# Altium schematic sheet SY_HR08_MCU_INTERFACE_V1.1.SchDoc
size A3; PageSetup: Record=PageOptions|CenterHorizontal=True|CenterVertical=True|PrintScale=0.71|XCorrection=1.00|YCorrection=1.00|PrintKind=2|BorderSize=5000000|LeftOffset=0|BottomOffset=0|Orientation=2|PaperLength=1000|PaperWidth=1000|Scale=100|PaperSource=7|PrintQuality=-3|MediaType=1|DitherType=10|PrintScaleMode=1|PaperKind=A4|PaperIndex=9
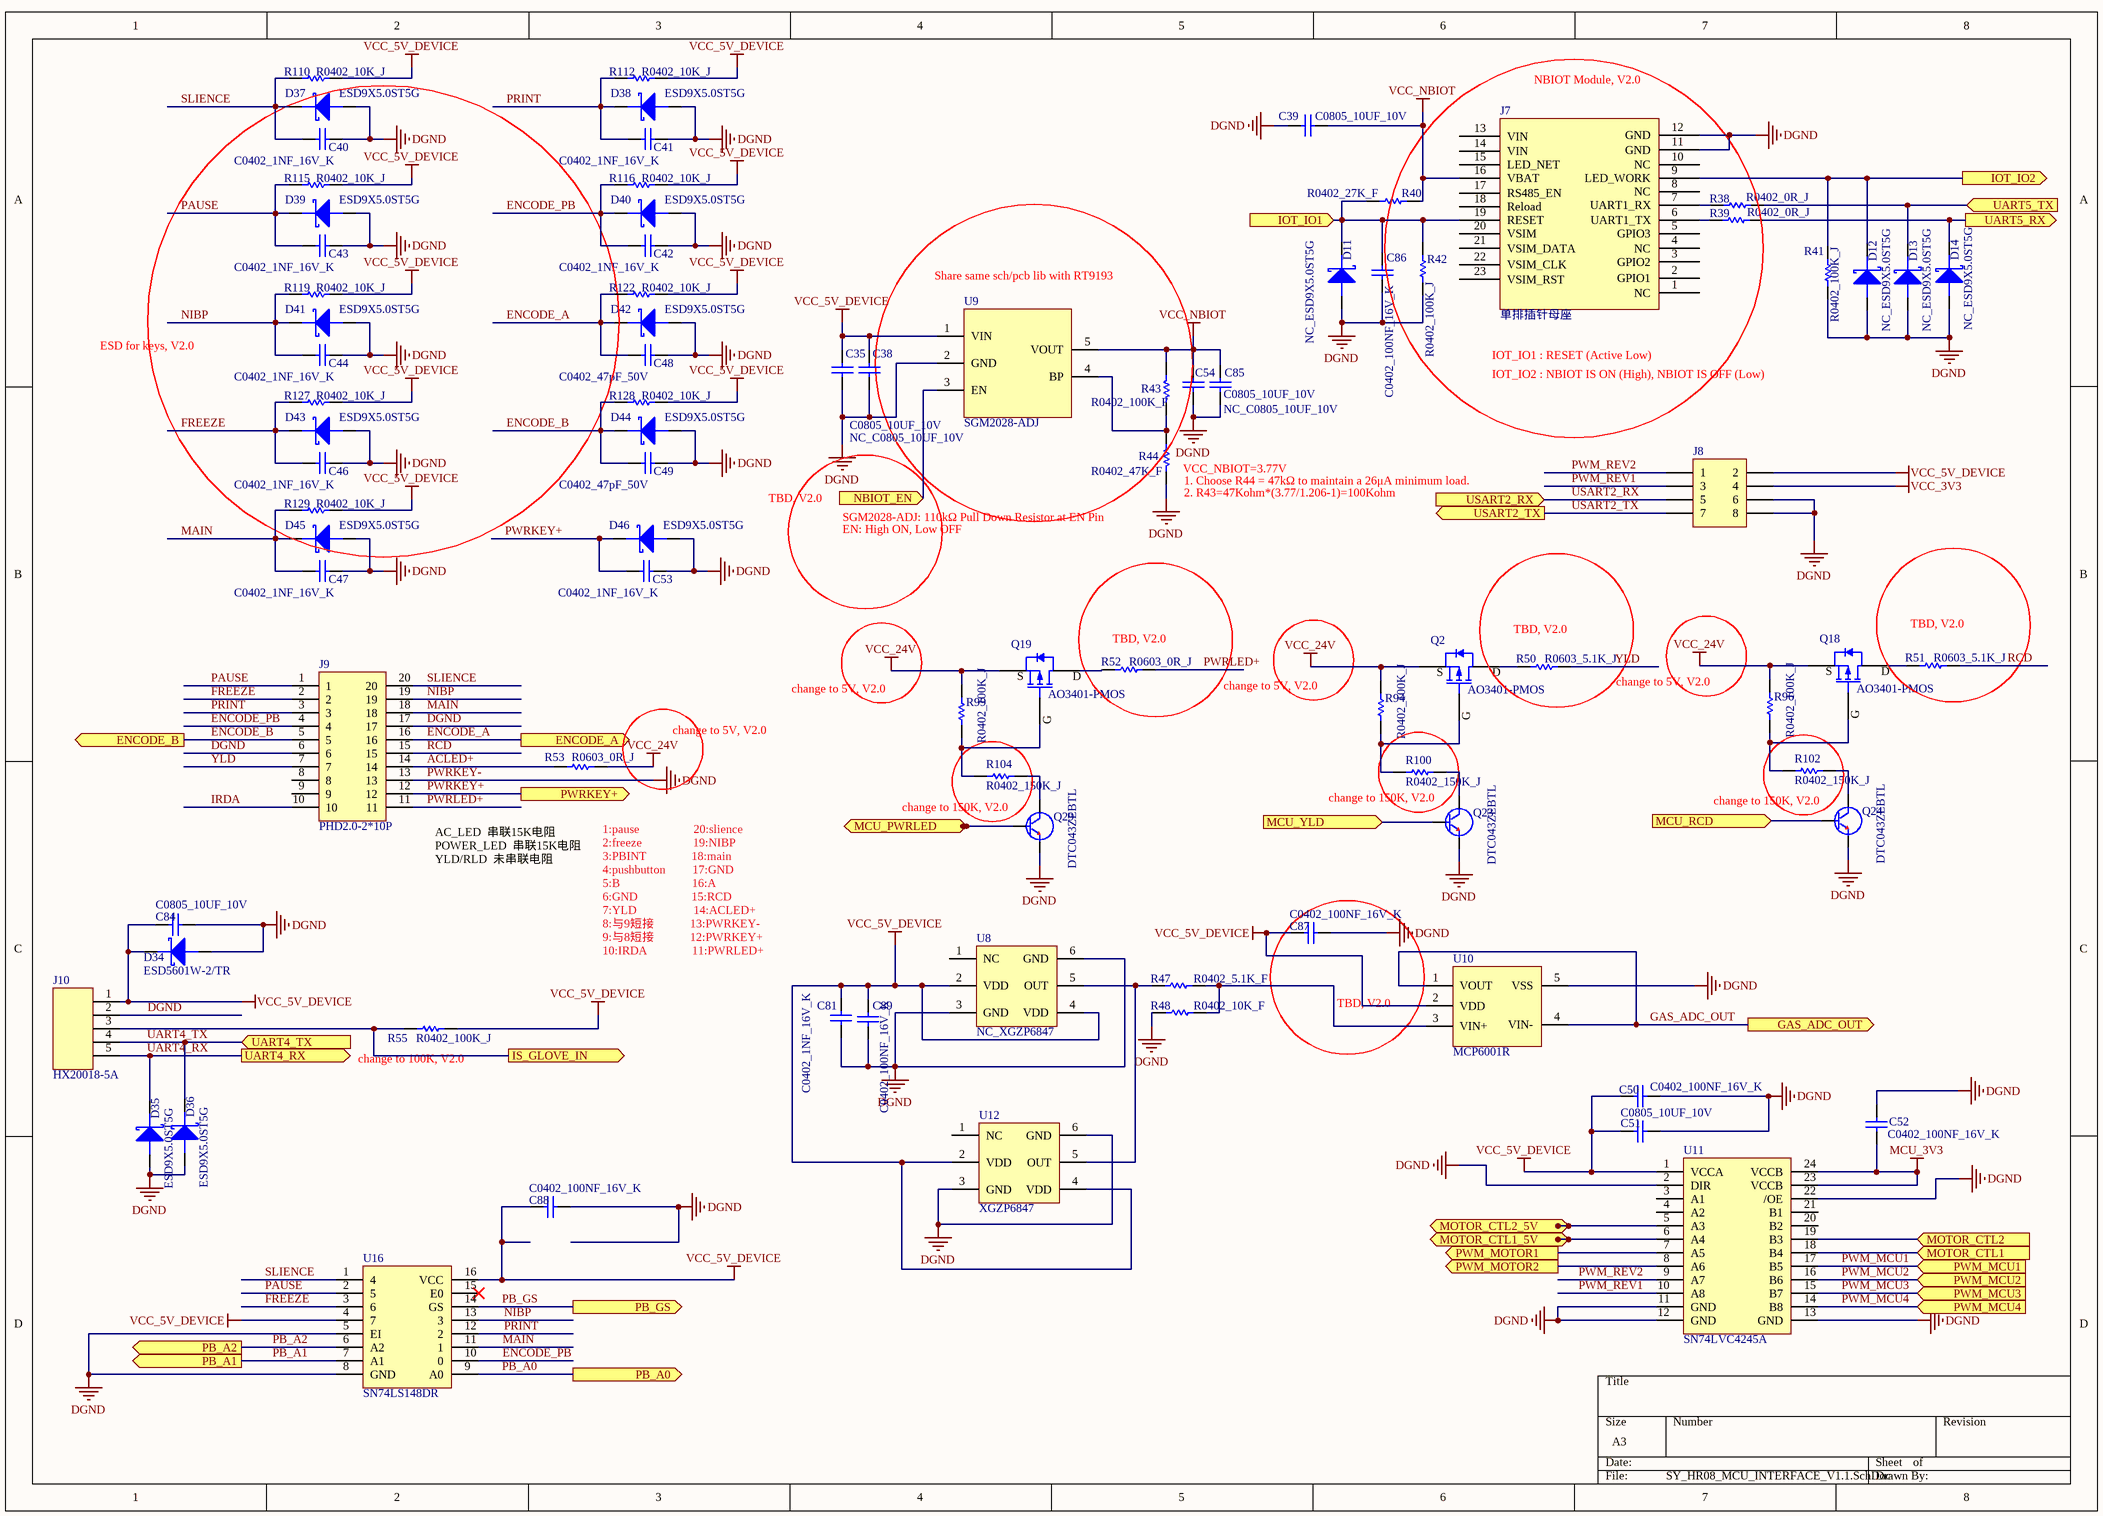
[diagram p0: SY_HR08_MCU_INTERFACE_V1.1.SchDoc]

## Parts
C35  C0805_10UF_10V  [CAP0805-B]
C38  NC_C0805_10UF_10V  [CAP0805-B]
C39  C0805_10UF_10V  [CAP0805-B]
C40  C0402_1NF_16V_K  [CAP0402_HQ]
C41  C0402_1NF_16V_K  [CAP0402_HQ]
C42  C0402_1NF_16V_K  [CAP0402_HQ]
C43  C0402_1NF_16V_K  [CAP0402_HQ]
C44  C0402_1NF_16V_K  [CAP0402_HQ]
C46  C0402_1NF_16V_K  [CAP0402_HQ]
C47  C0402_1NF_16V_K  [CAP0402_HQ]
C48  C0402_47pF_50V  [CAP0402_HQ]
C49  C0402_47pF_50V  [CAP0402_HQ]
C50  C0402_100NF_16V_K  [CAP0402_HQ]
C51  C0805_10UF_10V  [CAP0805-B]
C52  C0402_100NF_16V_K  [CAP0402_HQ]
C53  C0402_1NF_16V_K  [CAP0402_HQ]
C54  NC_C0805_10UF_10V  [CAP0805-B]
C81  C0402_1NF_16V_K  [CAP0402_HQ]
C84  C0805_10UF_10V  [CAP0805-B]
C85  C0805_10UF_10V  [CAP0805-B]
C86  C0402_100NF_16V_K  [CAP0402_HQ]
C87  C0402_100NF_16V_K  [CAP0402_HQ]
C88  C0402_100NF_16V_K  [CAP0402_HQ]
C89  C0402_100NF_16V_K  [CAP0402_HQ]
D11  NC_ESD9X5.0ST5G  [ESD9X5.0ST5G]
D12  NC_ESD9X5.0ST5G  [ESD9X5.0ST5G]
D13  NC_ESD9X5.0ST5G  [ESD9X5.0ST5G]
D14  NC_ESD9X5.0ST5G  [ESD9X5.0ST5G]
D34  ESD5601W-2/TR  [ESD5601W-2$2F$TR]
D35  ESD9X5.0ST5G  [ESD9X5.0ST5G]
D36  ESD9X5.0ST5G  [ESD9X5.0ST5G]
D37  ESD9X5.0ST5G  [ESD9X5.0ST5G]
D38  ESD9X5.0ST5G  [ESD9X5.0ST5G]
D39  ESD9X5.0ST5G  [ESD9X5.0ST5G]
D40  ESD9X5.0ST5G  [ESD9X5.0ST5G]
D41  ESD9X5.0ST5G  [ESD9X5.0ST5G]
D42  ESD9X5.0ST5G  [ESD9X5.0ST5G]
D43  ESD9X5.0ST5G  [ESD9X5.0ST5G]
D44  ESD9X5.0ST5G  [ESD9X5.0ST5G]
D45  ESD9X5.0ST5G  [ESD9X5.0ST5G]
D46  ESD9X5.0ST5G  [ESD9X5.0ST5G]
J7  单排插针母座  [USR-LTE-7S4]
J8  双排插针  [CON2X4(2.54MM)]  (value not drawn)
J9  PHD2.0-2*10P  [PHD2.0-20P]
J10  HX20018-5A  [HX20018-5A]
Q2  AO3401-PMOS  [AO3400]
Q18  AO3401-PMOS  [AO3400]
Q19  AO3401-PMOS  [AO3400]
Q23  DTC043ZEBTL  [DTC043ZEBTL$2F$$2F$DTC143ZE$2F$$2F$LDTC143ZET1G]
Q24  DTC043ZEBTL  [DTC043ZEBTL$2F$$2F$DTC143ZE$2F$$2F$LDTC143ZET1G]
Q29  DTC043ZEBTL  [DTC043ZEBTL$2F$$2F$DTC143ZE$2F$$2F$LDTC143ZET1G]
R38  R0402_0R_J  [RES0402_HQ]
R39  R0402_0R_J  [RES0402_HQ]
R40  R0402_27K_F  [RES0402_HQ]
R41  R0402_100K_J  [RES0402_HQ]
R42  R0402_100K_J  [RES0402_HQ]
R43  R0402_100K_F  [RES0402_HQ]
R44  R0402_47K_F  [RES0402_HQ]
R47  R0402_5.1K_F  [RES0402_HQ]
R48  R0402_10K_F  [RES0402_HQ]
R50  R0603_5.1K_J  [RES0603-A]
R51  R0603_5.1K_J  [RES0603-A]
R52  R0603_0R_J  [RES0603-A]
R53  R0603_0R_J  [RES0603-A]
R55  R0402_100K_J  [RES0402_HQ]
R94  R0402_100K_J  [RES0402_HQ]
R96  R0402_100K_J  [RES0402_HQ]
R99  R0402_100K_J  [RES0402_HQ]
R100  R0402_150K_J  [RES0402_HQ]
R102  R0402_150K_J  [RES0402_HQ]
R104  R0402_150K_J  [RES0402_HQ]
R110  R0402_10K_J  [RES0402_HQ]
R112  R0402_10K_J  [RES0402_HQ]
R115  R0402_10K_J  [RES0402_HQ]
R116  R0402_10K_J  [RES0402_HQ]
R119  R0402_10K_J  [RES0402_HQ]
R122  R0402_10K_J  [RES0402_HQ]
R127  R0402_10K_J  [RES0402_HQ]
R128  R0402_10K_J  [RES0402_HQ]
R129  R0402_10K_J  [RES0402_HQ]
U8  NC_XGZP6847  [XGZP6847300KPA]
U9  SGM2028-ADJ  [TPS7B6950]
U10  MCP6001R  [TOS23]
U11  SN74LVC4245A  [SN74LVC4245APW]
U12  XGZP6847  [XGZP6847300KPA]
U16  SN74LS148DR  [SOIC16_39MM]

## Ports
ENCODE_A (out), ENCODE_B (out), GAS_ADC_OUT (out), IOT_IO1 (in), IOT_IO2 (out), IS_GLOVE_IN (out), MCU_PWRLED (in), MCU_RCD (in), MCU_YLD (in), MOTOR_CTL1 (in), MOTOR_CTL1_5V (out), MOTOR_CTL2 (in), MOTOR_CTL2_5V (out), NBIOT_EN (in), PB_A0 (out), PB_A1 (out), PB_A2 (out), PB_GS (out), PWM_MCU1 (in), PWM_MCU2 (in), PWM_MCU3 (in), PWM_MCU4 (in), PWM_MOTOR1 (out), PWM_MOTOR2 (out), PWRKEY+ (out), UART4_RX (out), UART4_TX (in), UART5_RX (out), UART5_TX (in), USART2_RX (in), USART2_TX (out)

## Nets
DGND: C35.1 C38.1 C39.2 C40.1 C41.1 C42.1 C43.1 C44.1 C46.1 C47.1 C48.1 C49.1 C50.1 C51.2 C52.1 C53.1 C54.1 C81.2 C84.2 C85.1 C86.2 C87.1 C88.1 C89.2 D11.2 D12.2 D13.2 D14.2 D34.2 D35.2 D36.2 D37.2 D38.2 D39.2 D40.2 D41.2 D42.2 D43.2 D44.2 D45.2 D46.2 J7.11(GND) J7.12(GND) J8.6 J8.8 J9.6 J9.13 J9.17 J10.2 Q23.2(E) Q24.2(E) Q29.2(E) R41.1 R42.2 R44.1 R48.2 U8.3(GND) U8.6(GND) U9.2(GND) U10.5(VSS) U11.2(DIR) U11.11(GND) U11.12(GND) U11.13(GND) U11.22(/OE) U12.3(GND) U12.6(GND) U16.5(EI) U16.8(GND)  [also labelled PWRKEY-]
MCU_3V3: C52.2 U11.23(VCCB) U11.24(VCCB)
VCC_3V3: J8.4
VCC_5V_DEVICE: C35.2 C38.2 C50.2 C51.1 C81.1 C84.1 C87.2 C88.2 C89.1 D34.1 J8.2 J10.1 R55.2 R110.2 R112.2 R115.2 R116.2 R119.2 R122.2 R127.2 R128.2 R129.2 U8.2(VDD) U8.4(VDD) U9.1(VIN) U10.2(VDD) U11.1(VCCA) U12.2(VDD) U12.4(VDD) U16.4(7) U16.16(VCC)
VCC_24V: Q2.2(S) Q18.2(S) Q19.2(S) R53.2 R94.2 R96.2 R99.2
VCC_NBIOT: C39.1 C54.2 C85.2 J7.16(VBAT) R40.1 R43.2 U9.5(VOUT)
ACLED+: J9.14 R53.1
ENCODE_A: C48.2 D42.1 J9.16 R122.1 ; port ENCODE_A
ENCODE_B: C49.2 D44.1 J9.5 R128.1 ; port ENCODE_B
ENCODE_PB: C42.2 D40.1 J9.4 R116.1 U16.10(0)
FREEZE: C46.2 D43.1 J9.2 R127.1 U16.3(6)
GAS_ADC_OUT: U10.1(VOUT) U10.4(VIN-) ; port GAS_ADC_OUT
IOT_IO1: C86.1 D11.1 J7.19(RESET) R40.2 R42.1 ; port IOT_IO1
IOT_IO2: D12.1 J7.9(LED_WORK) R41.2 ; port IOT_IO2
IRDA: J9.10
IS_GLOVE_IN: J10.3 R55.1 ; port IS_GLOVE_IN
MAIN: C47.2 D45.1 J9.18 R129.1 U16.11(1)
MCU_PWRLED: Q29.1(B) ; port MCU_PWRLED
MCU_RCD: Q24.1(B) ; port MCU_RCD
MCU_YLD: Q23.1(B) ; port MCU_YLD
MOTOR_CTL1: U11.18(B4) ; port MOTOR_CTL1
MOTOR_CTL1_5V: U11.6(A4) ; port MOTOR_CTL1_5V
MOTOR_CTL2: U11.19(B3) ; port MOTOR_CTL2
MOTOR_CTL2_5V: U11.5(A3) ; port MOTOR_CTL2_5V
NBIOT_EN: U9.3(EN) ; port NBIOT_EN
NIBP: C44.2 D41.1 J9.19 R119.1 U16.13(3)
PAUSE: C43.2 D39.1 J9.1 R115.1 U16.2(5)
PB_A0: U16.9(A0) ; port PB_A0
PB_A1: U16.7(A1) ; port PB_A1
PB_A2: U16.6(A2) ; port PB_A2
PB_GS: U16.14(GS) ; port PB_GS
PRINT: C41.2 D38.1 J9.3 R112.1 U16.12(2)
PWM_MCU1: U11.17(B5) ; port PWM_MCU1
PWM_MCU2: U11.16(B6) ; port PWM_MCU2
PWM_MCU3: U11.15(B7) ; port PWM_MCU3
PWM_MCU4: U11.14(B8) ; port PWM_MCU4
PWM_MOTOR1: U11.7(A5) ; port PWM_MOTOR1
PWM_MOTOR2: U11.8(A6) ; port PWM_MOTOR2
PWM_REV1: J8.3 U11.10(A8)
PWM_REV2: J8.1 U11.9(A7)
PWRKEY+: C53.2 D46.1 J9.12 ; port PWRKEY+
PWRLED+: J9.11 R52.2
RCD: J9.15 R51.2
SLIENCE: C40.2 D37.1 J9.20 R110.1 U16.1(4)
UART4_RX: D35.1 J10.5 ; port UART4_RX
UART4_TX: D36.1 J10.4 ; port UART4_TX
UART5_RX: D14.1 R39.1 ; port UART5_RX
UART5_TX: D13.1 R38.2 ; port UART5_TX
USART2_RX: J8.5 ; port USART2_RX
USART2_TX: J8.7 ; port USART2_TX
YLD: J9.7 R50.2
NetJ7_6: J7.6(UART1_TX) R39.2
NetJ7_7: J7.7(UART1_RX) R38.1
NetQ2_1: Q2.1(G) R94.1 R100.2
NetQ2_3: Q2.3(D) R50.1
NetQ18_1: Q18.1(G) R96.1 R102.2
NetQ18_3: Q18.3(D) R51.1
NetQ19_1: Q19.1(G) R99.1 R104.2
NetQ19_3: Q19.3(D) R52.1
NetQ23_3: Q23.3(C) R100.1
NetQ24_3: Q24.3(C) R102.1
NetQ29_3: Q29.3(C) R104.1
NetR43_1: R43.1 R44.2 U9.4(BP)
NetR47_1: R47.1 R48.1 U10.3(VIN+)
NetR47_2: R47.2 U8.5(OUT) U12.5(OUT)

Not connected (* = marked no-connect by the designer): J7 1(NC) 2(GPIO1) 3(GPIO2) 4(NC) 5(GPIO3) 8(NC) 10(NC) 13(VIN) 14(VIN) 15(LED_NET) 17(RS485_EN) 18(Reload) 20(VSIM) 21(VSIM_DATA) 22(VSIM_CLK) 23(VSIM_RST); J9 8 9; U8 1(NC); U11 3(A1) 4(A2) 20(B2) 21(B1); U12 1(NC); U16 15(E0)*

## Notes on the sheet
- (near J7) NBIOT Module, V2.0
- (near U9) Share same sch/pcb lib with RT9193
- ESD for keys, V2.0
- IOT_IO1 : RESET (Active Low)
- IOT_IO2 : NBIOT IS ON (High), NBIOT IS OFF (Low)
- TBD, V2.0
- SGM2028-ADJ: 110kΩ Pull Down Resistor at EN Pin
- (near R44) VCC_NBIOT=3.77V
- (near R44) 1. Choose R44 = 47kΩ to maintain a 26μA minimum load.
- (near R44) 2. R43=47Kohm*(3.77/1.206-1)=100Kohm
- EN: High ON, Low OFF
- (near R52) TBD, V2.0
- (near R50) TBD, V2.0
- (near R51) TBD, V2.0
- change to 5V, V2.0
- (near R94) change to 5V, V2.0
- (near Q29) change to 150K, V2.0
- (near Q23) change to 150K, V2.0
- (near Q24) change to 150K, V2.0
- AC_LED  串联15K电阻
  POWER_LED  串联15K电阻
  YLD/RLD  未串联电阻
- 1:pause                  20:slience
  2:freeze                 19:NIBP
  3:PBINT               18:main
  4:pushbutton         17:GND
  5:B                        16:A
  6:GND                  15:RCD
  7:YLD                   14:ACLED+
  8:与9短接            13:PWRKEY-
  9:与8短接            12:PWRKEY+
  10:IRDA               11:PWRLED+
- (near R55) change to 100K, V2.0

## Library data of the parts
C35 C38 C39 C51 C54 C84 C85 = C0805_10UF_10V: 电容_10uF_0805_X5R_10V_K
C40-C44 C46-C50 C52 C53 C81 C86-C89 = C0402_100NF_16V_K: 电容_100nF_0402_X7R_16V_K; Geometry.Height: 0.55mm; Value: 100NF
D11-D14 D35-D46 = ESD9X5.0ST5G: TVS_单路_单向_5.0V_65pF; Manufacturer: ONSEMI(安森美); Part Number: HQ11510010010; Geometry.Height: 0.43mm
D34 = ESD5601W-2/TR: TVS_浪涌+静电二合一管_单向_7V_170pf; Manufacturer: Will(韦尔); Part Number: HQ11510029000; Geometry.Height: 1mm; Value: ESD5601W-2/TR
J7 = USR-NB75
J8 = Header 4X2: Header, 4-Pin, Dual row
J9 = PHD2.0-20P: 2.0mm间距接插件 双排插座
J10 = HX20018-5A: HX20018-5A  2.0mm
Q23 Q24 Q29 = DTC043ZEBTL: NPN三极管_100mA_EMT3F
R38-R44 R55 R110 R112 R115 R116 R119 R122 R127-R129 = R0402_10K_J: 电阻10K(0402-0.0625W-J)
R47 R48 R94 R96 R99 R100 R102 R104 = R0402_100K_J: 电阻100K(0402-0.0625W-J)
R50-R53 = R0603_0R_J: 电阻0R(0603-0.1W-J)
U8 U12 = XGZP6847: XGZP6847_300KPG  气压范围-100kpa - 300kpa
U9 = RT9193-33: 单电池电压转换器  3.3V; Geometry.Height: 1.45mm
U10 = MCP6001R: 1MHz, Low-Power Op Amp
U11 = SN74LVC4245AWP: 3.3V 至 5V 移位器
U16 = SN74LS148DR: 8 线路到 3 线路优先编码器